# Altium schematic sheet Electronic Dice.SchDoc
size A4
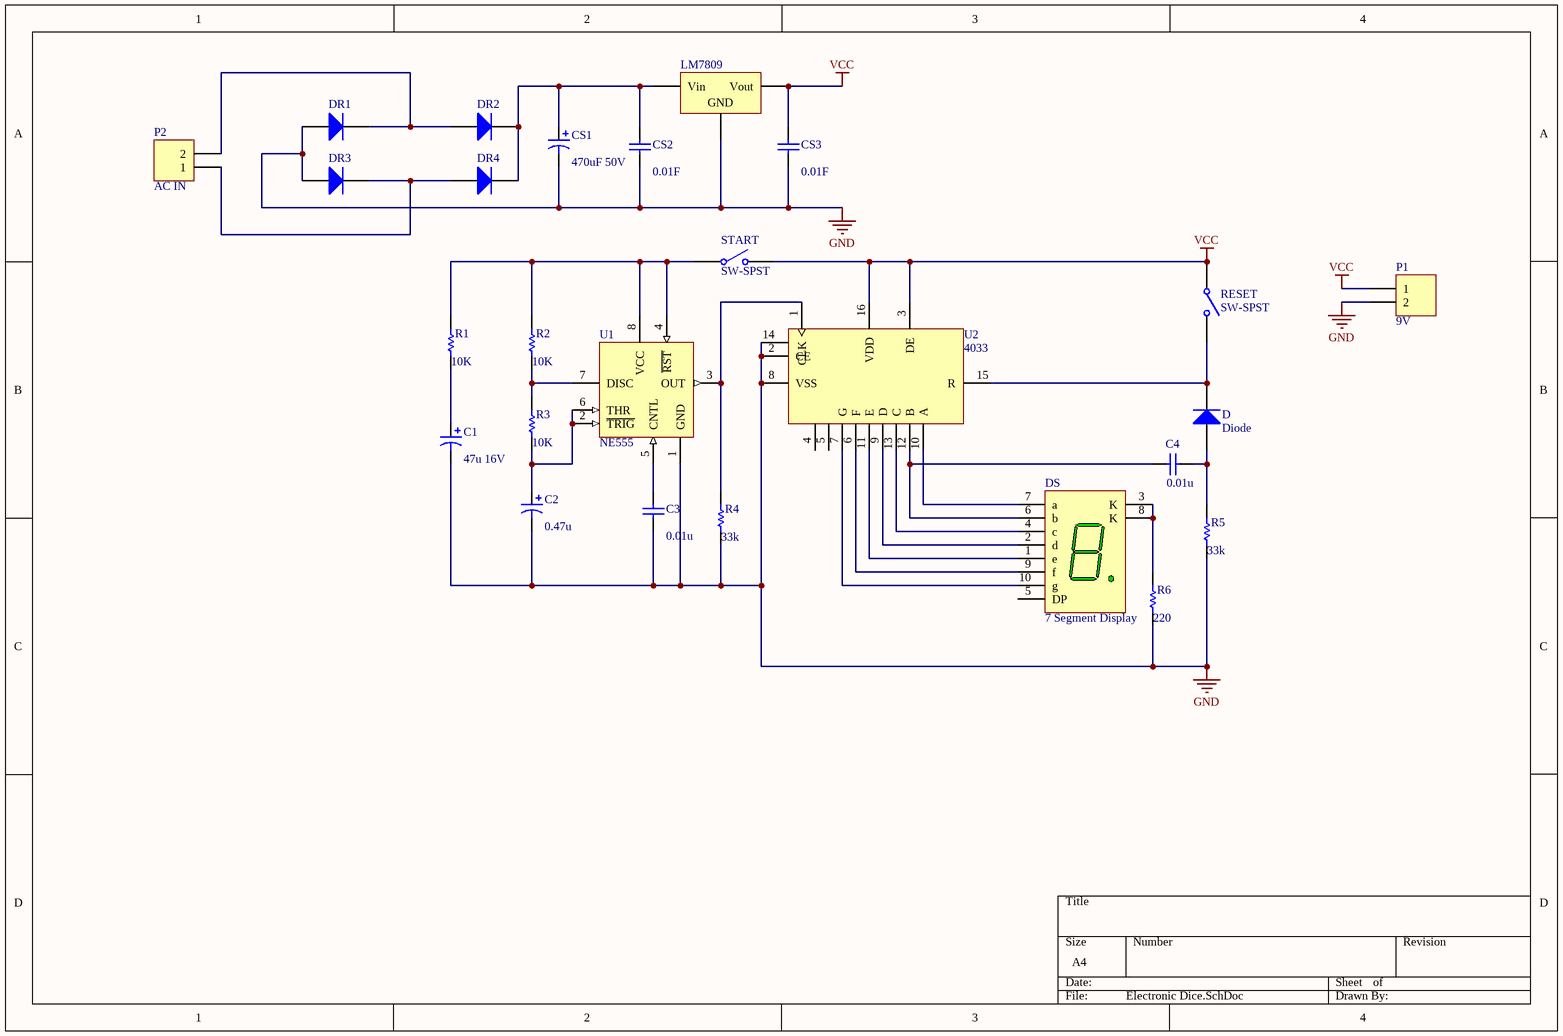
[diagram p0: Electronic Dice.SchDoc]

## Parts
C1  value 47u 16V  [RAD-0.2]
C2  value 0.47u  [RAD-0.2]
C3  value 0.01u  [RAD-0.2]
C4  value 0.01u  [RAD-0.2]
CS1  value 470uF 50V  [RAD-0.3]
CS2  value 0.01F  [RAD-0.2]
CS3  value 0.01F  [RAD-0.2]
D  Diode  [DO-41]
DR1  (no value)  [DO-41]
DR2  (no value)  [DO-41]
DR3  (no value)  [DO-41]
DR4  (no value)  [DO-41]
DS  7 Segment Display  [HDSP-51]
LM7809  (no value)  [E3]
P1  9V  [HDR1X2]
P2  AC IN  [HDR1X2]
R1  value 10K  [R6.35x2.3]
R2  value 10K  [R6.35x2.3]
R3  value 10K  [R6.35x2.3]
R4  value 33k  [R6.35x2.3]
R5  value 33k  [R6.35x2.3]
R6  value 220  [R6.35x2.3]
RESET  SW-SPST  [SPST-2]
START  SW-SPST  [SPST-2]
U1  NE555  [626-05]
U2  4033  [J16A]

## Nets
GND: C1.2 C2.2 C3.1 CS1.2 CS2.1 CS3.1 DR1.1(A) DR3.1(A) LM7809.2(GND) P1.2 R4.1 R5.1 R6.1 U1.1(GND) U2.2(CE) U2.8(VSS) U2.14
VCC: CS3.2 LM7809.3(Vout) P1.1 RESET.1(COMMON) START.2(NO) U2.3(DE) U2.16(VDD)
NetC1_1: C1.1 R1.1
NetC2_1: C2.1 R3.1 U1.2(~{TRIG}) U1.6(THR)
NetC3_2: C3.2 U1.5(CNTL)
NetC4_1: C4.1 D.1(A) R5.2
NetC4_2: C4.2 DS.6(b) U2.12(B)
NetCS1_1: CS1.1 CS2.2 DR2.2(K) DR4.2(K) LM7809.1(Vin)
NetD_2: D.2(K) RESET.2(NO) U2.15(R)
NetDR1_2: DR1.2(K) DR2.1(A) P2.2
NetDR3_2: DR3.2(K) DR4.1(A) P2.1
NetDS_1: DS.1(e) U2.11(E)
NetDS_2: DS.2(d) U2.9(D)
NetDS_3: DS.3(K) DS.8(K) R6.2
NetDS_4: DS.4(c) U2.13(C)
NetDS_7: DS.7(a) U2.10(A)
NetDS_9: DS.9(f) U2.6(F)
NetDS_10: DS.10(g) U2.7(G)
NetR1_2: R1.2 R2.2 START.1(COMMON) U1.4(~{RST}) U1.8(VCC)
NetR2_1: R2.1 R3.2 U1.7(DISC)
NetR4_2: R4.2 U1.3(OUT) U2.1(CLK)

Not connected (* = marked no-connect by the designer): DS 5(DP); U2 4 5

## Library data of the parts
C1 C2 CS1 = Cap Pol1: Polarized Capacitor (Radial); Published: 8-Jun-2000; LatestRevisionDate: 17-Jul-2002; LatestRevisionNote: Re-released for DXP Platform.; PackageReference: RB7.6-15; Publisher: Altium Limited; PackageDescription: Polarized Capacitor (Radial); 2 Leads
C3 C4 CS2 CS3 = Cap: Capacitor; Published: 8-Jun-2000; LatestRevisionDate: 17-Jul-2002; LatestRevisionNote: Re-released for DXP Platform.; PackageReference: RAD-0.3; Publisher: Altium Limited; PackageDescription: Radial Cap, Thru-Hole; 2 Leads; 0.3 in Pin Spacing
D = Diode: Default Diode; Published: 8-Jun-2000; LatestRevisionDate: 17-Jul-2002; LatestRevisionNote: Re-released for DXP Platform.; PackageVersion: Sep-1996; PackageReference: SMC; Publisher: Altium Limited; PackageDescription: DO-214-AB/SMC; 2 C-Bend Leads; Body 7.9 x 5.9 mm, inc. leads (LxW); Code_JEDEC: DO-214-AB
DR1-DR4 = Diode 1N4007: 1 Amp General Purpose Rectifier; Published: 8-Jun-2000; LatestRevisionDate: 17-Jul-2002; LatestRevisionNote: Re-released for DXP Platform.; DatasheetVersion: 1998; PackageVersion: Aug-1999; PackageReference: DO-41; Publisher: Altium Limited; PackageDescription: Diode, Axial; Body 5.2 x 2.7 mm (LxDia. max), Lead Dia. 0.86 mm (max); Code_JEDEC: DO-204-AL; ComponentLink1Description: Manufacturer Link; ComponentLink1URL: http://www.fairchildsemi.com/; ComponentLink2Description: Datasheet; ComponentLink2URL: http://www.fairchildsemi.com/ds/1N%2F1N4001.pdf
DS = HDSP-513G: 14.22 mm General Purpose Green 7-Segment Display: CC, RH DP; LuminousIntensity: 2001 ucd (Minimum).; Published: 26-May-2004; LatestRevisionDate: 11-Oct-2004; LatestRevisionNote: Display outline superimposed on PCB Footprint.; DatasheetDocument: 25-Jul-2001; PackageDocument: 25-Jul-2001; PackageReference: HDSP-51; Publisher: Altium Limited; LED_Colour: Green; ComponentLink1Description: Manufacturer Link; ComponentLink1URL: http://www.agilent.com/; ComponentLink2Description: Datasheet; ComponentLink2URL: http://cp.literature.agilent.com/litweb/pdf/5988-2968EN.pdf
LM7809 = Volt Reg: Voltage Regulator; Published: 24-Mar-1999; LatestRevisionDate: 29-May-2009; LatestRevisionNote: IPC-7351 Footprint Added.; PackageReference: D2PAK; Publisher: Altium Limited; PackageDescription: 3-Pin Transistor Outline Package 2.54 mm Pitch, 15.1 mm Lead Span
P1 P2 = Header 2: Header, 2-Pin; LatestRevisionDate: 17-Jul-2002; LatestRevisionNote: Re-released for DXP Platform.; Publisher: Altium Limited
R1-R6 = ERG12: Metal Oxide Film Resistor, 0.1 Ohm to 47k Ohm Range, 2% and 5% Tolerance, 0.5 W; Published: 17-Dec-2003; PackageReference: R6.35x2.3; Publisher: Altium Limited; ComponentLink1Description: Manufacturer Link; ComponentLink1URL: http://www.panasonic.com/industrial/components/resistive_products.htm; ComponentLink2Description: Datasheet; ComponentLink2URL: http://www.panasonic.com/industrial/components/pdf/AOA0000CE18.pdf
RESET START = SW-SPST: Single-Pole, Single-Throw Switch; Published: 24-Mar-1999; LatestRevisionDate: 17-Jul-2002; LatestRevisionNote: Re-released for DXP Platform.; PackageReference: SPST-2; Publisher: Altium Limited; PackageDescription: Switch; 2 Leads
U1 = MC1455BP1: Timing Circuit; Note: The reset pin should be tied to the supply voltage when not in use.; Published: 28-Feb-2003; DatasheetVersion: Jan-2002, Rev. 6; PackageVersion: 1998; PackageReference: 626-05; Publisher: Altium Limited; PackageDescription: DIP; 8 Leads; Row Spacing 7.62 mm; Pitch 2.54 mm; ComponentLink1Description: Manufacturer Link; ComponentLink1URL: http://www.onsemi.com/; ComponentLink2Description: Datasheet; ComponentLink2URL: http://www.onsemi.com/pub/Collateral/MC1455-D.PDF
U2 = 54F161ADM: Synchronous Presettable Binary Counter; Published: 17-Jul-2002; LatestRevisionDate: 29-May-2009; LatestRevisionNote: Component Body Added.; DatasheetVersion: Nov-1994; PackageVersion: 2000; PackageReference: J16A; Publisher: Altium Limited; PackageDescription: CerDIP, 16-Pin, Row Spacing 7.62 mm, Pitch 2.54 mm; ComponentLink1Description: Manufacturer Link; ComponentLink1URL: http://www.fairchildsemi.com/